# EAGLE design ab-main-mini (EAGLE 7.3.0)
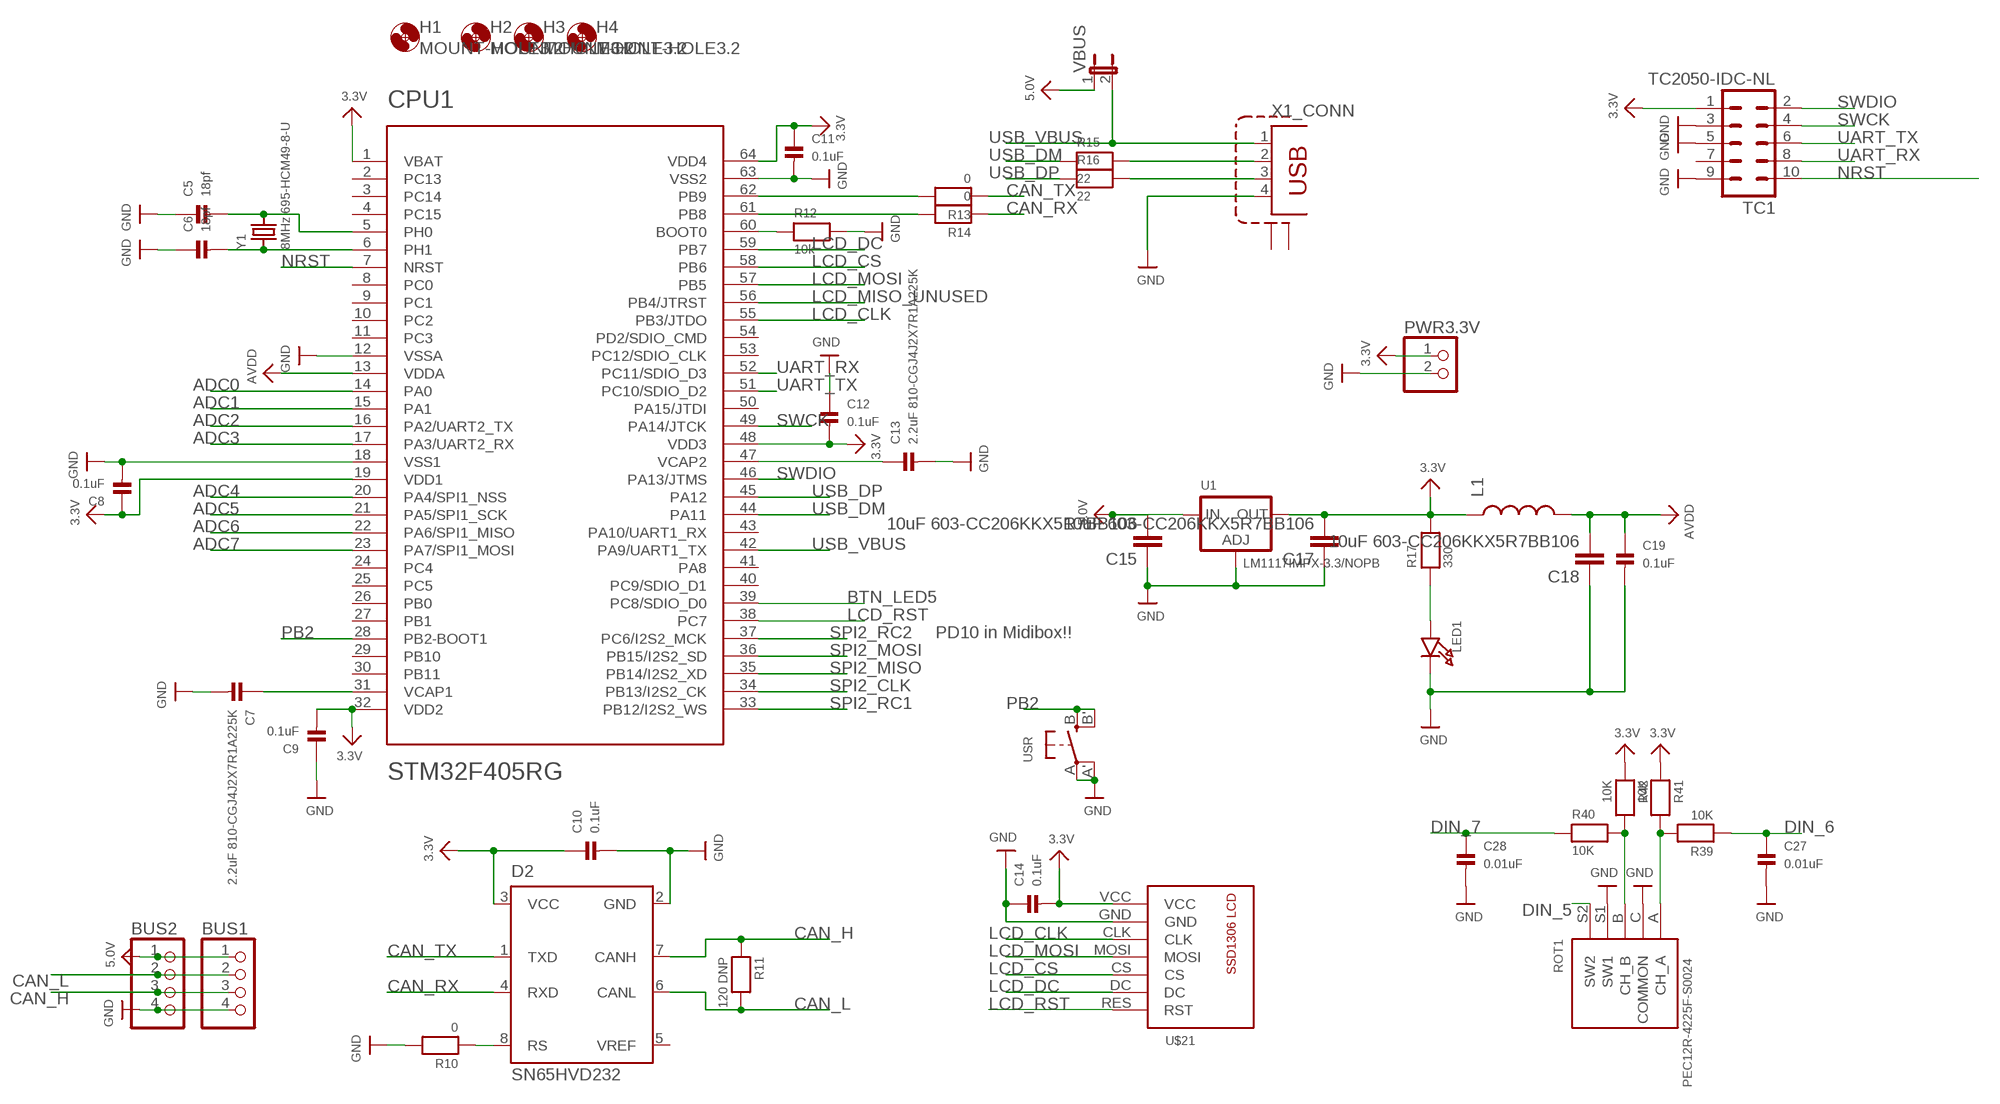
[diagram p0: schematic, sheet 1]

## Parts
BUS1  HEADER-1X4ROUND  [1X04_ROUND]
BUS2  HEADER-1X4ROUND  [1X04_ROUND]
C5  18pf  CAP_CERAMIC0603  [0603]
C6  18pf  CAP_CERAMIC0603  [0603]
C7  2.2uF 810-CGJ4J2X7R1A225K  CAP_CERAMIC0805  [0805]
C8  0.1uF  CAP_CERAMIC0603  [0603]
C9  0.1uF  CAP_CERAMIC0603  [0603]
C10  0.1uF  CAP_CERAMIC0603  [0603]
C11  0.1uF  CAP_CERAMIC0603  [0603]
C12  0.1uF  CAP_CERAMIC0603  [0603]
C13  2.2uF 810-CGJ4J2X7R1A225K  CAP_CERAMIC0805  [0805]
C14  0.1uF  CAP_CERAMIC0603  [0603]
C15  10uF 603-CC206KKX5R7BB106  CAP1206  [1206]
C17  10uF 603-CC206KKX5R7BB106  CAP1206  [1206]
C18  10uF 603-CC206KKX5R7BB106  CAP1206  [1206]
C19  0.1uF  CAP_CERAMIC0603  [0603]
C27  0.01uF  CAP_CERAMIC0603  [0603]
C28  0.01uF  CAP_CERAMIC0603  [0603]
CPU1  STM32F405RG  [TQFP64]
D2  SN65HVD232  SN65HVD230  [SO8]
H1  MOUNT-HOLE3.2  [3,2]
H2  MOUNT-HOLE3.2  [3,2]
H3  MOUNT-HOLE3.2  [3,2]
H4  MOUNT-HOLE3.2  [3,2]
L1  INDUCTOR0805  [0805]
LED1  LED0603  [CHIPLED_0603]
PWR3.3V  HEADER-1X2ROUND  [1X02_ROUND]
R10  0  RESISTOR_0603  [_0603]
R11  120 DNP  RESISTOR_0603  [_0603]
R12  10k  RESISTOR_0603  [_0603]
R13  0  RESISTOR_0603  [_0603]
R14  0  RESISTOR_0603  [_0603]
R15  22  RESISTOR0603  [0603]
R16  22  RESISTOR0603  [0603]
R17  330  RESISTOR0603  [0603]
R39  10K  RESISTOR0603  [0603]
R40  10K  RESISTOR0603  [0603]
R41  10K  RESISTOR0603  [0603]
R42  10K  RESISTOR0603  [0603]
ROT1  PEC12R-4225F-S0024  PEC11-4215K-S0024  [PEC111-4XXXK-SXXXX]
TC1  TC2050-IDC-NL  [TC2050-IDC-NL]
U1  LM1117IMPX-3.3/NOPB  LM1117SOT223-REFLOW  [SOT223-R]
U$21  SSD1306-7PIN  [SSD1306-7PIN]
USR  SWITCH_TACT_SMT  [EVQ-Q2]
VBUS  JUMPER2  [JUMPER2]
X1  TE-292304-1  [TE-292304-1]
Y1  8MHz 695-HCM49-8-U  CRYSTALSMD  [HC49UP]

## Nets
3.3V: C8.1 C9.2 C10.1 C11.1 C12.2 C14.2 C17.2 CPU1.1(VBAT) CPU1.19(VDD1) CPU1.32(VDD2) CPU1.48(VDD3) CPU1.64(VDD4) D2.3(VCC) L1.1 PWR3.3V.1 R17.2 R41.1 R42.1 TC1.1 U1.2(OUT) U$21.VCC
5.0V: BUS1.1 BUS2.1 C15.2 U1.3(IN) VBUS.1
ADC0: CPU1.14(PA0)
ADC1: CPU1.15(PA1)
ADC2: CPU1.16(PA2/UART2_TX)
ADC3: CPU1.17(PA3/UART2_RX)
ADC4: CPU1.20(PA4/SPI1_NSS)
ADC5: CPU1.21(PA5/SPI1_SCK)
ADC6: CPU1.22(PA6/SPI1_MISO)
ADC7: CPU1.23(PA7/SPI1_MOSI)
AVDD: C18.2 C19.1 CPU1.13(VDDA) L1.2
BTN_LED5: CPU1.39(PC8/SDIO_D0)
CAN_H: BUS1.3 BUS2.3 D2.7(CANH) R11.1
CAN_L: BUS1.2 BUS2.2 D2.6(CANL) R11.2
CAN_RX: D2.4(RXD) R14.1
CAN_TX: D2.1(TXD) R13.1
DIN_5: ROT1.S2(SW2)
DIN_6: C27.1 R39.1
DIN_7: C28.1 R40.1
GND: BUS1.4 BUS2.4 C5.1 C6.1 C7.2 C8.2 C9.1 C10.2 C11.2 C12.1 C13.2 C14.1 C15.1 C17.1 C18.1 C19.2 C27.2 C28.2 CPU1.12(VSSA) CPU1.18(VSS1) CPU1.63(VSS2) D2.2(GND) LED1.C PWR3.3V.2 R10.2 R12.2 ROT1.C(COMMON) ROT1.S1(SW1) TC1.3 TC1.5 TC1.9 U1.1(ADJ) U$21.GND USR.A'(P1) USR.A(P) X1.4
LCD_CLK: CPU1.55(PB3/JTDO) U$21.CLK
LCD_CS: CPU1.58(PB6) U$21.CS
LCD_DC: CPU1.59(PB7) U$21.DC
LCD_MISO_UNUSED: CPU1.56(PB4/JTRST)
LCD_MOSI: CPU1.57(PB5) U$21.MOSI
LCD_RST: CPU1.38(PC7) U$21.RES(RST)
N$1: C6.2 CPU1.6(PH1) Y1.1
N$2: C5.2 CPU1.5(PH0) Y1.2
N$3: C13.1 CPU1.47(VCAP2)
N$4: C7.1 CPU1.31(VCAP1)
N$5: LED1.A R17.1
N$6: CPU1.60(BOOT0) R12.1
N$7: R15.2 X1.2
N$8: R16.2 X1.3
N$13: CPU1.62(PB9) R13.2
N$27: CPU1.61(PB8) R14.2
N$32: R40.2 R42.2 ROT1.B(CH_B)
N$33: R39.2 R41.2 ROT1.A(CH_A)
N$73: D2.8(RS) R10.1
NRST: CPU1.7(NRST) TC1.10
PB2: CPU1.28(PB2-BOOT1) USR.B'(S1) USR.B(S)
SPI2_CLK: CPU1.34(PB13/I2S2_CK)
SPI2_MISO: CPU1.35(PB14/I2S2_XD)
SPI2_MOSI: CPU1.36(PB15/I2S2_SD)
SPI2_RC1: CPU1.33(PB12/I2S2_WS)
SPI2_RC2: CPU1.37(PC6/I2S2_MCK)
SWCK: CPU1.49(PA14/JTCK) TC1.4
SWDIO: CPU1.46(PA13/JTMS) TC1.2
UART_RX: CPU1.52(PC11/SDIO_D3) TC1.8
UART_TX: CPU1.51(PC10/SDIO_D2) TC1.6
USB_DM: CPU1.44(PA11) R15.1
USB_DP: CPU1.45(PA12) R16.1
USB_VBUS: CPU1.42(PA9/UART1_TX) VBUS.2 X1.1
Unconnected: CPU1.2(PC13) CPU1.3(PC14) CPU1.4(PC15) CPU1.8(PC0) CPU1.9(PC1) CPU1.10(PC2) CPU1.11(PC3) CPU1.24(PC4) CPU1.25(PC5) CPU1.26(PB0) CPU1.27(PB1) CPU1.29(PB10) CPU1.30(PB11) CPU1.40(PC9/SDIO_D1) CPU1.41(PA8) CPU1.43(PA10/UART1_RX) CPU1.50(PA15/JTDI) CPU1.53(PC12/SDIO_CLK) CPU1.54(PD2/SDIO_CMD) D2.5(VREF) TC1.7 X1.P$1(SHIELD:S1) X1.P$2(SHIELD:S2)

## Notes on the sheet
- PD10 in Midibox!!

## Library data of the parts
BUS1 BUS2 = microbuilder:HEADER-1X4: PIN HEADER
C5-C14 C19 C27 C28 = microbuilder:CAP_CERAMIC: Ceramic Capacitors 0402 - 0402 Surface Mount Capacitors 16pF 50V 5% [Digikey: 445-4899-2-ND] 18pF 50V 5% [Digikey: 490-1281-2-ND] 22pF 50V 5% [Digikey: 490-1283-2-ND] 68pF 50V 5% [Digikey: 490-1289-2-ND] 0.1uF 10V 10% [Digikey: 490-1318-2-ND] 1.0uF 6.3V 10% [Digikey: 490-1320-2-ND] 0603 - 0603 Surface Mount Capacitors 16 pF 50V 5% [Digikey: 445-5051-2-ND] 22 pF 50V [Digikey: PCC220ACVTR-ND] 33 pF 50V 5% [Digikey: 490-1415-1-ND] 56pF 50V 5% [Digikey: 490-1421-1-ND] 220pF 50V 5% [Digikey: 445-1285-1-ND] 680 pF 50V 2200 pF 50V 5% C0G [Digikey: 445-1297-1-ND] 5600 pF 100V 5% X7R [Digikey: 478-3711-1-ND] 0.1 µF 25V 10% [Digikey: PCC2277TR-ND] 0.22 µF 16V 10% X7R [Digikey: 445-1318-1-ND] 1.0 µF 25V 10% [Digikey: 445-5146-2-ND] 0603 - RF Specific 3pF 250V +/-0.1pF RF [Digikey: 712-1347-1-ND] 18 pF 250V 5% [Digikey: 478-3505-1-ND or 712-1322-1-ND] 56 pF 250V 5% C0G RF [Digikey: 490-4867-1-ND] 68 pF 250V RF [Digikey: 490-4868-1-ND] 0805 - 0805 Surface Mount Capacitors 220 pF 250V 2% RF Ceramic Capacitor [Digikey: 712-1398-1-ND] 1000 pF 50V 2% NP0 Ceramic Capacitor [Digikey: 478-3760-1-ND] 0.1 µF 25V 10% Ceramic Capacitor [Digikey: PCC1828TR-ND] 1.0 µF 16V 10% Ceramic Capacitor[Digikey: 490-1691-2-ND] 10.0 µF 10V 10% Ceramic Capacitor[Digikey: 709-1228-1-ND] 10.0 uF 16V 10% Ceramic Capacitor [Digikey: 478-5165-2-ND] 47 uF 6.3V 20% Ceramic Capacitor [Digikey: 587-1779-1-ND or 399-5506-1-ND] 1206 - 1206 Surface Mount Capacitors 47uF 10V 20% Ceramic Capacitor [Digikey: 490-5528-1-ND or 399-5508-1-ND or 445-6010-1-ND] 100uF 6.3V -20%, +80% Y5V Ceramic Capacitor (Digikey: 490-4512-1-ND, Mouser: 81-GRM31CF50J107ZE1L)
C15 C17 C18 = SparkFun-Passives:CAP: Capacitor Standard 0603 ceramic capacitor, and 0.1" leaded capacitor.
CPU1 = SparkFun-DigitalIC:STM32F405RG: ARM DSP Chip used on the WAV Trigger board.
D2 = omc:SN65HVD230: SN65HVD230 - 3.3V CAN Transceiver - 3.3V operation - ISO 11898 compliant - up to 1Mbps - up to 120 nodes - listen only mode - slope control
H1-H4 = holes:MOUNT-HOLE: MOUNTING HOLE with drill center marker
L1 = SparkFun-Passives:INDUCTOR: Inductors Basic Inductor/Choke - 0603 and 1206. Footprints are not proven and vary greatly between part numbers. INDUCTOR POWER 3.3UH 4.0A SMD 0.197" L x 0.197" W x 0.177" H (5.00mm x 5.00mm x 4.50mm)
LED1 = microbuilder:LED: LED 0603 - 0603 Surface Mount Package 2mA: Green LED - Low Power (3.9mcd, 2ma, 1.7Vf) - Digikey: 475-2709-2-ND Orange LED - Low Power (9.8mcd, 2ma, 1.8Vf) - Digikey: 475-1194-2-ND Red LED - Low Power (5mcd, 2ma, 1.8Vf) - Digikey: 475-1195-2-ND Yellow LED - Low Power (7mcd, 2ma, 1.8Vf) - Digikey: 475-1196-2-ND 5mA: Blue LED - Low Power (17mcd, 5ma, 2.9Vf) - Digikey: LNJ937W8CRACT-ND 0805 - 0805 Surface Mount Package 2mA: Red LED (8.8mcd, 2mA, 1.8Vf, Clear) - Low Power [Digikey: 475-2510-1-ND] Green LED (5mcd, 2mA, 1.8Vf, Clear) - Low Power [Digikey: 475-2730-1-ND] Yellow LED (11.3mcd, 2mA, 1.8Vf, Clear) - Low Power [Digikey: 475-2555-1-ND] 20mA: Red LED (104mcd, 20mA, Diffused) - LS R976 [Digikey: 475-1278-6-ND] Red LED (12mcd, 20mA, 2.0Vf, Clear) - APT2012EC [Digikey: 754-1128-1-ND] Green LED (15mcd, 20mA, 2.2Vf, Clear) - APT2012GC [Digikey: 754-1131-1-ND] Orange LED (160mcd, 20mA, 2.1Vf, Clear) - APT2012SECK [Digikey: 754-1130-1-ND] 1206 - 1206 Surface Mount Package Green LED (26mcd, 20mA, Diffused) - LG N971 [Digikey: 475-1407-6-ND] Red LED (15mcd, 20mA, Diffused) - LH N974 [Digikey: 475-1416-6-ND]
PWR3.3V = microbuilder:HEADER-1X2: PIN HEADER
R10-R17 R39-R42 = microbuilder:RESISTOR: Resistors 0402 - 0402 Surface Mount Package 22 Ohm 1% 1/16W [Digikey: 311-22.0LRTR-ND] 33 Ohm 5% 1/16W 1.0K 5% 1/16W 1.5K 5% 1/16W 2.0K 1% 1/16W 10.0K 1% 1/16W [Digikey: 311-10.0KLRTR-ND] 10.0K 5% 1/16W [Digikey: RMCF0402JT10K0TR-ND] 12.1K 1% 1/16W [Digikey: 311-22.0LRTR-ND] 100.0K 5% 1/16W 0603 - 0603 Surface Mount Package 0 Ohm 1/10 Watt 1% Resistor 15 Ohm 1/10 Watt 1% Resistor 33 Ohm 1/10 Watt 1% Resistor 49.9 Ohm 1/10 Watt 1% Resistor 100 Ohm 1/10 Watt 1% Resistor 150 Ohm 1/10 Watt 1% Resistor 240 Ohm 1/10 Watt 1% Resistor 390 Ohm 1/10 Watt 1% Resistor 560 Ohm 1/10 Watt 1% Resistor 680 Ohm 1/10 Watt 1% Resistor 750 Ohm 1/10 Watt 1% Resistor 1.0K Ohm 1/10 Watt 1% Resistor 1.5K Ohm 1/10 Watt 1% Resistor 2.0K Ohm 1/10 Watt 1% Resistor 2.2K Ohm 1/10 Watt 1% Resistor 3.3K Ohm 1/10 Watt 1% Resistor 4.7K Ohm 1/10 Watt 1% Resistor 10.0K Ohm 1/10 Watt 1% Resistor 12.0K Ohm 1/10 Watt 1% Resistor 12.1K Ohm 1/10 Watt 1% Resistor 20.0K Ohm 1/10 Watt 1% Resistor 33.0K Ohm 1/10 Watt 1% Resistor 100.0K Ohm 1/10 Watt 1% Resistor 0805 - 0805 Surface Mount Package 0 Ohm 1/8 Watt 1% Resistor 33 Ohm 1/8 Watt 1% Resistor 100 Ohm 1/8 Watt 1% Resistor 150 Ohm 1/8 Watt 1% Resistor 200 Ohm 1/8 Watt 1% Resistor 240 Ohm 1/8 Watt 1% Resistor 330 Ohm 1/8 Watt 1% Resistor 390 Ohm 1/8 Watt 1% Resistor 470 Ohm 1/8 Watt 1% Resistor 1.0K Ohm 1/8 Watt 1% Resistor 1.5K Ohm 1/8 Watt 1% Resistor 2.0K Ohm 1/8 Watt 1% Resistor 4.7K Ohm 1/8 Watt 1% Resistor 5.1K Ohm 1/8 Watt 1% Resistor 5.6K Ohm 1/8 Watt 1% Resistor 10.0K Ohm 1/8 Watt 1% Resistor 22.0K Ohm 1/8 Watt 1% Resistor 33.0K Ohm 1/8 Watt 1% Resistor 100K Ohm 1/8 Watt 1% Resistor 1206 - 1206 Surface Mount Package 2012 - 2010 Surface Mount Package 0.11 Ohm 1/2 Watt 1% Resistor - Digikey: RHM.11UCT-ND
ROT1 = keves:PEC11-4215K-S0024
TC1 = TagConnect:TC2050-IDC: Tag-Connect In Circuit Programming & Debug Cable 10 Pin http://www.tag-connect.com
U1 = microbuilder:LM1117: LM1117 Voltage Regulator LM1117 Adjustable Voltage regulator [Digikey: LM1117IMP-ADJDKR-ND] LM1117 3.3V Voltage regulator [AP1117E33GDIDKR-ND] LM1117 5.0V Voltage regulator [AP1117E50GDIDKR-ND] SOT223-REFLOW - SOT223 package for solder paste/reflow ovens SOT223-WAVE - SOT223 package for hand-soldering (larger pads) Note: For the fixed-voltage regulators, simply set the ADJ pin to GND.
U$21 = keves:SSD1306-7PIN: https://www.aliexpress.com/item/free-shipping-0-96-inch-OLED-display-module-128X64-OLED-For-arduino-I2C-IIC-SPI-7p/32595065668.html?ws_ab_test=searchweb0_0,searchweb201602_1_116_117_10065_10068_114_10067_115_10069_113_10017_10080_10082_10081_10060_10061_10062_10056_10055_10054_10059_10078_10079_10073_10070_10052_10053_10050_10051,searchweb201603_6&btsid=51ed1bae-6cee-4f36-9ddd-1a85c2e0ff68
USR = microbuilder:SWITCH_TACT_SMT: SMT Tact Switches 6x6mm - Digikey: P12940SCT-ND KMR2 (4.6x2.8mm) - Digikey: 401-1426-1-ND EVQ-PQHB55 - Light Touch, 160GF (4.5x4.5mm) - Digikey: P8090SCT-ND
VBUS = microbuilder:JUMPER2: JUMPER - 2 Pins
X1 = keves:TE-292304-1: USB A Female connector
Y1 = microbuilder:CRYSTAL: Crystals HC49UP - Surface Mount Crystal 4.0MHz 18pF +/-30ppm Surface Mount Crystal [Digikey: 535-9857-1-ND] 12.0 MHz Surface Mount Crystal [Digikey: 535-9869-6-ND] 25.0 MHz Surface Mount Crystal [Digikey: 535-9078-1-ND] 2.5 x 2.0mm - MEMs SMT Crystal 16.0 MHz 10pF 20ppm 2.5 x 2.0mm Crystal [Digikey -40-85°C: 535-10923-1-ND] 3.2 x 2.5mm - MEMs SMT Crystal 12.0 MHz 8pF 15ppm 3.2 x 2.5mm Crystal [Digikey: -10-70°C: 644-1047-1-ND -40-125°C: 644-1128-1-ND] 16.0 MHz 8pF 15ppm 3.2 x 2.5mm Crystal [Digikey: -10-70°C: 644-1049-1-ND -40-125°C: 644-1129-2-ND] 16.0 MHz 10pF 10ppm 3.2 x 2.5mm Crystal [Digikey: 644-1100-1-ND] 27.12 MHz 18pF 30ppm 3.2 x 2.5mm Crystal [Digikey: 887-1424-1-ND] 27.12MHz 10pF 10ppm 3.2 x 2.5mm Crystal [Digikey: 887-1329-1-ND] 4.9 x 1.8mm - MEMs SMT Crystal 32.768 KHz 12.5pF 20ppm 4.9 x 1.8mm Crystal [Digikey: SE2415CT-ND] 8.0 x 3.8mm - Surface Mount Crystal 32.768kHz 12.5pF 20ppm -40°C-85°C [Digikey: 535-9166-2-ND] Cylinder 32.768KHz Cylinder Crystal (2x6mm body) [Ex. Digikey: 300-8341-2-ND]

## Board
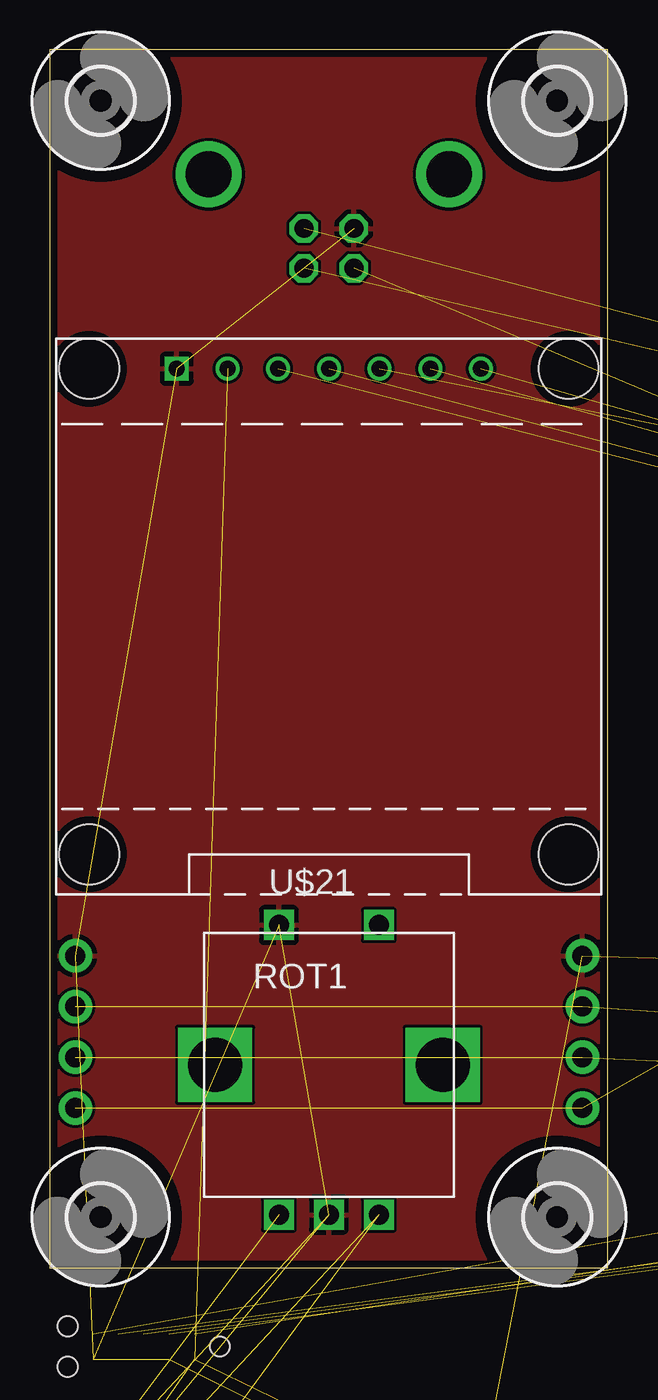
[diagram p1: board, top side]
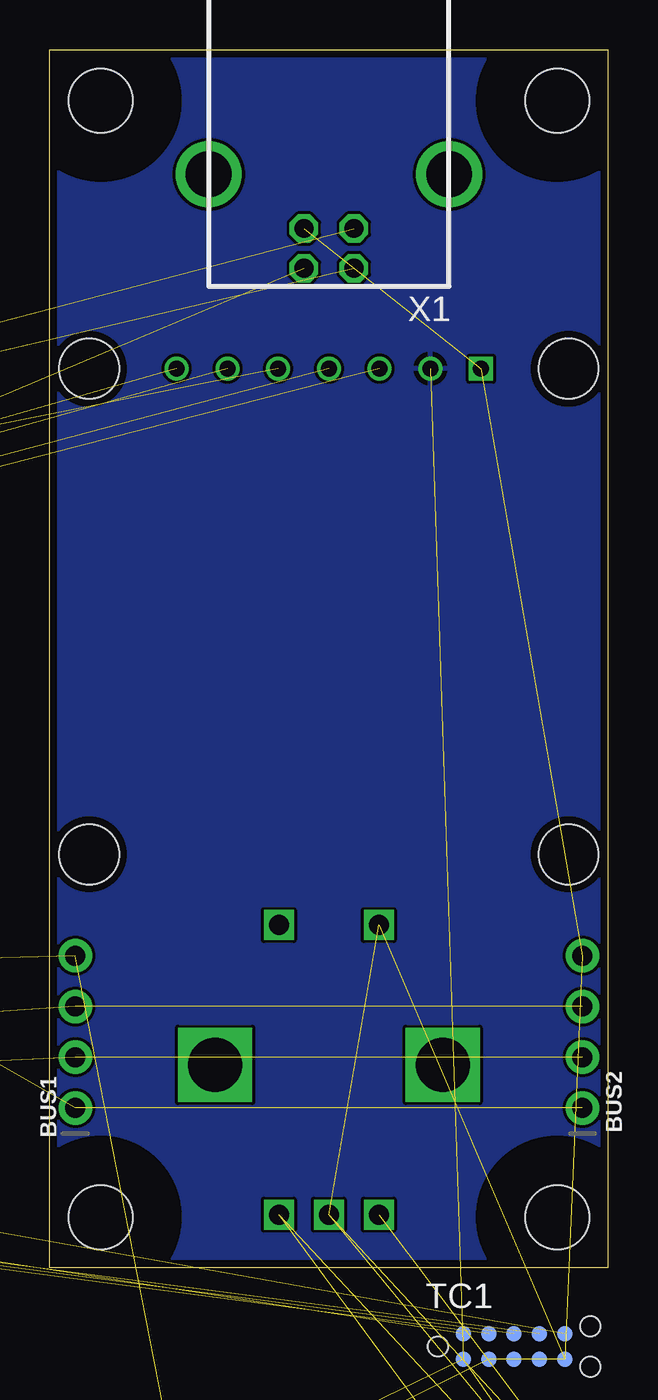
[diagram p2: board, bottom side, seen from below]

Size 27.94 x 60.96 mm. Coordinates in mm from the lower left corner, seen from the top.
Outline: 0,0 27.94,0 27.94,60.96 0,60.96 0,0
Copper layers (1*16): Top 0.0356mm / dielectric 1.5011mm / Bottom 0.0356mm
Design rules "oshpark *": minimum track width 6mil, minimum drill 13mil, track to track 6mil, track to pad 6mil, pad to pad 6mil, via to via 6mil, smd to smd 6mil, copper to edge 15mil, drill to drill 6mil, minimum pad ring 7mil, minimum via ring 7mil, stop-mask expansion 3mil, vias tented up to drill 0mil, thermal gap 10mil

### Footprints (pad centres in the part's own frame; a part is rotated, then mirrored left to right if it is on the bottom)
1X04_ROUND = drill 1 pad 1.676: 1 -3.81,0; 2 -1.27,0; 3 1.27,0; 4 3.81,0
0603 = smd 1.1 x 1: 1 -0.85,0; 2 0.85,0
0805 = smd 1.3 x 1.5: 1 -0.95,0; 2 0.95,0
1206 = smd 1.6 x 1.8: 1 -1.4,0; 2 1.4,0
TQFP64 = smd 0.22 x 1: 1 -3.75,-5.75; 2 -3.25,-5.75; 3 -2.75,-5.75; 4 -2.25,-5.75; 5 -1.75,-5.75; 6 -1.25,-5.75; 7 -0.75,-5.75; 8 -0.25,-5.75; 9 0.25,-5.75; 10 0.75,-5.75; 11 1.25,-5.75; 12 1.75,-5.75; 13 2.25,-5.75; 14 2.75,-5.75; 15 3.25,-5.75; 16 3.75,-5.75; 33 3.75,5.75; 34 3.25,5.75; 35 2.75,5.75; 36 2.25,5.75; 37 1.75,5.75; 38 1.25,5.75; 39 0.75,5.75; 40 0.25,5.75; 41 -0.25,5.75; 42 -0.75,5.75; 43 -1.25,5.75; 44 -1.75,5.75; 45 -2.25,5.75; 46 -2.75,5.75; 47 -3.25,5.75; 48 -3.75,5.75 | smd 1 x 0.22: 17 5.75,-3.75; 18 5.75,-3.25; 19 5.75,-2.75; 20 5.75,-2.25; 21 5.75,-1.75; 22 5.75,-1.25; 23 5.75,-0.75; 24 5.75,-0.25; 25 5.75,0.25; 26 5.75,0.75; 27 5.75,1.25; 28 5.75,1.75; 29 5.75,2.25; 30 5.75,2.75; 31 5.75,3.25; 32 5.75,3.75; 49 -5.75,3.75; 50 -5.75,3.25; 51 -5.75,2.75; 52 -5.75,2.25; 53 -5.75,1.75; 54 -5.75,1.25; 55 -5.75,0.75; 56 -5.75,0.25; 57 -5.75,-0.25; 58 -5.75,-0.75; 59 -5.75,-1.25; 60 -5.75,-1.75; 61 -5.75,-2.25; 62 -5.75,-2.75; 63 -5.75,-3.25; 64 -5.75,-3.75
SO8 = smd 0.65 x 1.75: 1 -1.905,-2.8; 2 -0.635,-2.8; 3 0.635,-2.8; 4 1.905,-2.8; 5 1.905,2.8; 6 0.635,2.8; 7 -0.635,2.8; 8 -1.905,2.8
3,2 = hole 3.2: 0,0
0805' = smd 0.8 x 1.2: 1 -0.9,0; 2 0.9,0
CHIPLED_0603 = smd 0.8 x 0.8: A 0,-0.75; C 0,0.75
1X02_ROUND = drill 1 pad 1.676: 1 -1.27,0; 2 1.27,0
_0603 = smd 0.9 x 0.8: 1 -0.762,0; 2 0.762,0
PEC111-4XXXK-SXXXX = drill 1 square: A -2.5,-7.5; B 2.5,-7.5; C 0,-7.5; S1 -2.5,7; S2 2.5,7 | drill 2.7 square: P$1 -5.7,0; P$2 5.7,0
TC2050-IDC-NL = smd 0.787 x 0.787: 1 -2.54,-0.635; 2 -2.54,0.635; 3 -1.27,-0.635; 4 -1.27,0.635; 5 0,-0.635; 6 0,0.635; 7 1.27,-0.635; 8 1.27,0.635; 9 2.54,-0.635; 10 2.54,0.635 | hole 0.991: -3.81,0; 3.81,1.016; 3.81,-1.016
SOT223-R = smd 1.3 x 1.3: 1 -2.3,-3.05; 2 0,-3.05; 3 2.3,-3.05 | smd 3.6 x 1.3: 4 0,3.05
SSD1306-7PIN = drill 0.8: CLK -2.54,24.3; CS 7.62,24.3; DC 5.08,24.3; MOSI 0,24.3; RES 2.54,24.3; VCC -5.08,24.3 | drill 0.8 square: GND -7.62,24.3 | hole 3: -12,24.3; 12,24.3; -12,0; 12,0
EVQ-Q2 = smd 3.2 x 1.2: A -3.4,-2; A' 3.4,-2; B -3.4,2; B' 3.4,2
JUMPER2 = drill 1 pad 1.93 octagon: 1 2.54,0; 2 0,0
TE-292304-1 = drill 0.95 octagon: 1 1.25,4.71; 2 -1.25,4.71; 3 -1.25,2.71; 4 1.25,2.71 | drill 2.3: P$1 6.02,0; P$2 -6.02,0
HC49UP = smd 5.334 x 1.93: 1 -4.826,0; 2 4.826,0

### Placement (x,y rotation side)
BUS1  26.67,11.81 90 bottom
BUS2  1.27,11.81 90 bottom
C5  117.6,14.48 270 bottom  (outside the outline)
C6  117.6,22.1 90 bottom  (outside the outline)
C7  136.14,28.19 180 bottom  (outside the outline)
C8  127.38,27.05 0 bottom  (outside the outline)
C9  137.92,25.91 0 bottom  (outside the outline)
C10  22.1,-12.19 0 bottom  (outside the outline)
C11  126.36,12.32 0 bottom  (outside the outline)
C12  137.79,13.46 90 bottom  (outside the outline)
C13  140.59,15.11 270 bottom  (outside the outline)
C14  122.43,48.64 270 bottom  (outside the outline)
C15  65.41,27.69 0 bottom  (outside the outline)
C17  63.5,16 90 bottom  (outside the outline)
C18  132.59,23.37 270 bottom  (outside the outline)
C19  130.56,22.86 90 bottom  (outside the outline)
C27  -42.93,-57.91 0 top  (outside the outline)
C28  -36.83,-57.91 0 top  (outside the outline)
CPU1  131.57,19.56 90 bottom  (outside the outline)
D2  146.3,10.16 90 bottom  (outside the outline)
H1  2.54,2.54 0 top
H2  25.4,2.54 0 top
H3  2.54,58.42 0 top
H4  25.4,58.42 0 top
L1  [0805']  134.37,22.86 270 bottom  (outside the outline)
LED1  127,36.07 270 bottom  (outside the outline)
PWR3.3V  87.38,-10.54 270 top  (outside the outline)
R10  75.69,13.72 180 bottom  (outside the outline)
R11  72.64,9.14 270 bottom  (outside the outline)
R12  131.32,12.19 180 bottom  (outside the outline)
R13  140.72,9.65 0 bottom  (outside the outline)
R14  140.72,11.43 0 bottom  (outside the outline)
R15  140.97,19.81 180 bottom  (outside the outline)
R16  140.97,18.03 180 bottom  (outside the outline)
R17  130.56,36.07 180 bottom  (outside the outline)
R39  -30.73,-57.91 0 top  (outside the outline)
R40  -42.93,-60.33 0 top  (outside the outline)
R41  -36.83,-60.33 0 top  (outside the outline)
R42  -30.73,-60.33 0 top  (outside the outline)
ROT1  13.97,10.16 0 top
TC1  4.7,-3.94 0 bottom
U1  66.93,22.73 90 bottom  (outside the outline)
U$21  13.97,20.7 0 top
USR  125.35,37.85 270 bottom  (outside the outline)
VBUS  61.59,30.48 270 top  (outside the outline)
X1  13.97,54.74 180 bottom
Y1  121.41,18.29 270 bottom  (outside the outline)

### Tracks (layer width: path | path; a pad name or v marks a point on that pad's centre or on a via)
3.3V  (20 unrouted)
  pour Bottom: 0.13,70.99 0.13,0.13 27.81,0.13 27.81,70.99
5.0V  (4 unrouted)
AVDD  (3 unrouted)
CAN_H  (3 unrouted)
CAN_L  (3 unrouted)
CAN_RX  (1 unrouted)
CAN_TX  (1 unrouted)
DIN_6  (1 unrouted)
DIN_7  (1 unrouted)
GND  (35 unrouted)
  pour Top: 0.13,70.99 0.13,0.13 27.81,0.13 27.81,70.99
LCD_CLK  (1 unrouted)
LCD_CS  (1 unrouted)
LCD_DC  (1 unrouted)
LCD_MOSI  (1 unrouted)
LCD_RST  (1 unrouted)
N$1  (2 unrouted)
N$2  (2 unrouted)
N$3  (1 unrouted)
N$4  (1 unrouted)
N$5  (1 unrouted)
N$6  (1 unrouted)
N$7  (1 unrouted)
N$8  (1 unrouted)
N$13  (1 unrouted)
N$27  (1 unrouted)
N$32  (2 unrouted)
N$33  (2 unrouted)
N$73  (1 unrouted)
NRST  (1 unrouted)
PB2  (2 unrouted)
SWCK  (1 unrouted)
SWDIO  (1 unrouted)
UART_RX  (1 unrouted)
UART_TX  (1 unrouted)
USB_DM  (1 unrouted)
USB_DP  (1 unrouted)
USB_VBUS  (2 unrouted)

### Text on the board
tNames: Eran Rundstein, 2016